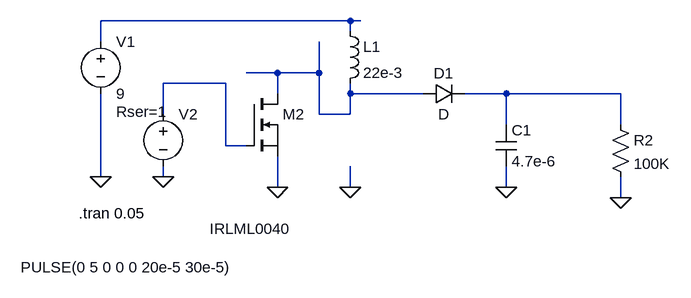
[diagram p0: schematic pmos-boost.asc]
pmos-boost.asc, the LTspice schematic file:
Version 4
SHEET 1 1388 680
WIRE 512 16 128 16
WIRE 528 16 512 16
WIRE 512 32 512 16
WIRE 128 48 128 16
WIRE 400 96 352 96
WIRE 464 96 464 48
WIRE 464 96 400 96
WIRE 320 112 224 112
WIRE 400 128 400 96
WIRE 512 128 512 112
WIRE 624 128 512 128
WIRE 752 128 688 128
WIRE 928 128 752 128
WIRE 224 160 224 112
WIRE 464 160 464 96
WIRE 512 160 512 128
WIRE 512 160 464 160
WIRE 752 176 752 128
WIRE 928 176 928 128
WIRE 320 208 320 112
WIRE 352 208 320 208
WIRE 128 256 128 128
WIRE 224 256 224 240
WIRE 400 272 400 224
WIRE 512 272 512 240
WIRE 752 272 752 240
WIRE 928 288 928 256
FLAG 128 256 0
FLAG 224 256 0
FLAG 400 272 0
FLAG 512 272 0
FLAG 752 272 0
FLAG 928 288 0
SYMBOL voltage 128 32 R0
WINDOW 123 0 0 Left 2
WINDOW 39 24 124 Left 2
SYMATTR InstName V1
SYMATTR Value 9
SYMATTR SpiceLine Rser=1
SYMBOL voltage 224 144 R0
WINDOW 3 -219 251 Left 2
WINDOW 123 0 0 Left 2
WINDOW 39 0 0 Left 2
SYMATTR InstName V2
SYMATTR Value PULSE(0 5 0 0 0 20e-5 30e-5)
SYMBOL nmos 352 128 R0
WINDOW 3 -56 208 Left 2
SYMATTR InstName M2
SYMATTR Value IRLML0040
SYMBOL ind 496 16 R0
SYMATTR InstName L1
SYMATTR Value 22e-3
SYMATTR SpiceLine Rser=10
SYMBOL diode 624 144 R270
WINDOW 0 32 32 VTop 2
WINDOW 3 0 32 VBottom 2
SYMATTR InstName D1
SYMBOL cap 736 176 R0
SYMATTR InstName C1
SYMATTR Value 4.7e-6
SYMBOL res 912 160 R0
SYMATTR InstName R2
SYMATTR Value 100K
TEXT 94 312 Left 2 !.tran 0.05

The netlist it stands for:
* pmos-boost.asc
V1 N001 0 9 Rser=1
V2 N003 0 PULSE(0 5 0 0 0 20e-5 30e-5)
M2 N002 N003 0 0 IRLML0040
L1 N001 N002 22e-3 Rser=10
D1 N002 N004 D
C1 N004 0 4.7e-6
R2 N004 0 100K
.model D D
.lib standard.dio
.model NMOS NMOS
.model PMOS PMOS
.lib standard.mos
.tran 0.05
.backanno
.end